# Altium schematic sheet SH1 - NUCLEO HEADERS.SchDoc: Nucleo Headers
size B; CheckedBy: Wolfgang Windholtz; Engineer: Sahil Kale; Revision: 1; SheetNumber: 1; SheetTotal: 6
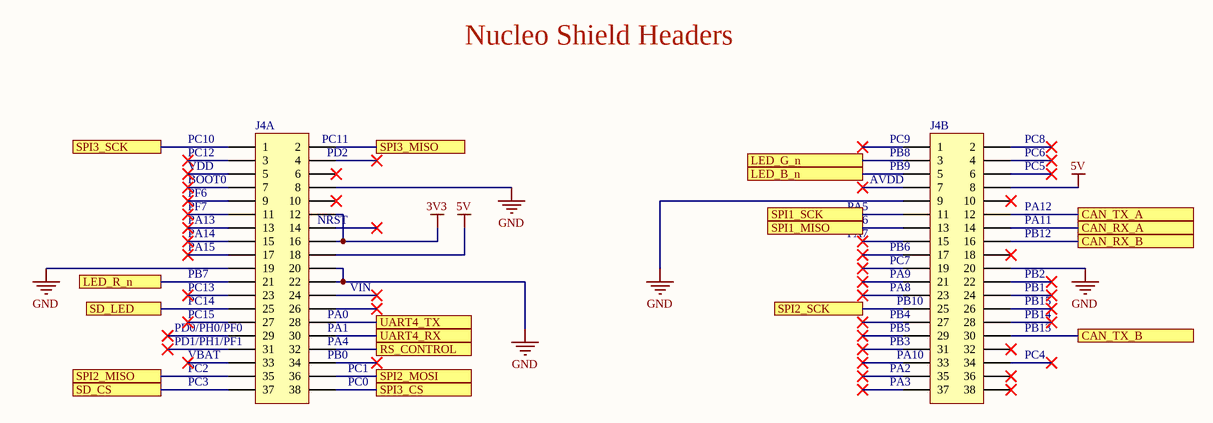
[diagram p0: SH1 - NUCLEO HEADERS.SchDoc]

## Parts
J4  HEADER_NUCLEO  [HEADER_NUCLEO]  (value not drawn)  (parts A,B of 2)

## Ports
CAN_RX_A, CAN_RX_B, CAN_TX_A, CAN_TX_B, LED_B_n, LED_G_n, LED_R_n, RS_CONTROL, SD_CS, SD_LED, SPI1_MISO, SPI1_SCK, SPI2_MISO, SPI2_MOSI, SPI2_SCK, SPI3_CS, SPI3_MISO, SPI3_SCK, UART4_RX, UART4_TX

## Nets
3V3: J4.12 J4.16
5V: J4.18 J4.46(8)
GND: J4.8 J4.19 J4.20 J4.22 J4.47(9) J4.58(20)
CAN_RX_A: J4.52(14) ; port CAN_RX_A
CAN_RX_B: J4.54(16) ; port CAN_RX_B
CAN_TX_A: J4.50(12) ; port CAN_TX_A
CAN_TX_B: J4.68(30) ; port CAN_TX_B
LED_B_n: J4.43(5) ; port LED_B_n
LED_G_n: J4.41(3) ; port LED_G_n
LED_R_n: J4.21 ; port LED_R_n
RS_CONTROL: J4.32 ; port RS_CONTROL
SD_CS: J4.37 ; port SD_CS
SD_LED: J4.25 ; port SD_LED
SPI1_MISO: J4.51(13) ; port SPI1_MISO
SPI1_SCK: J4.49(11) ; port SPI1_SCK
SPI2_MISO: J4.35 ; port SPI2_MISO
SPI2_MOSI: J4.36 ; port SPI2_MOSI
SPI2_SCK: J4.63(25) ; port SPI2_SCK
SPI3_CS: J4.38 ; port SPI3_CS
SPI3_MISO: J4.2 ; port SPI3_MISO
SPI3_SCK: J4.1 ; port SPI3_SCK
UART4_RX: J4.30 ; port UART4_RX
UART4_TX: J4.28 ; port UART4_TX

Not connected (* = marked no-connect by the designer): J4 3* 4* 5* 6* 7* 9* 10* 11* 13* 14* 15* 17* 23* 24* 26* 27* 29* 31* 33* 34* 39(1)* 40(2)* 42(4)* 44(6)* 45(7)* 48(10)* 53(15)* 55(17)* 56(18)* 57(19)* 59(21)* 60(22)* 61(23)* 62(24)* 64(26)* 65(27)* 66(28)* 67(29)* 69(31)* 70(32)* 71(33)* 72(34)* 73(35)* 74(36)* 75(37)* 76(38)*

## Notes on the sheet
- Nucleo Shield Headers
- (near J4) PC10
- (near J4) PC12
- (near J4) BOOT0
- (near J4) VDD
- (near J4) PC11
- (near J4) PD2
- (near J4) AVDD
- (near J4) PC9
- (near J4) PB8
- (near J4) PB9
- (near J4) PC8
- (near J4) PC6
- (near J4) PC5
- (near J4) PF7
- (near J4) PF6
- (near J4) PA13
- (near J4) PA14
- (near J4) NRST
- (near J4) PA5
- (near J4) PA6
- (near J4) PA7
- (near J4) PA12
- (near J4) PA11
- (near J4) PB12
- (near J4) PA15
- (near J4) PB7
- (near J4) PC13
- (near J4) PC14
- (near J4) PC15
- (near J4) PA0
- (near J4) VIN
- (near J4) PB6
- (near J4) PC7
- (near J4) PA9
- (near J4) PA8
- (near J4) PB4
- (near J4) PB10
- (near J4) PB1
- (near J4) PB2
- (near J4) PB15
- (near J4) PB14
- (near J4) PD0/PH0/PF0
- (near J4) PD1/PH1/PF1
- (near J4) PC2
- (near J4) VBAT
- (near J4) PA1
- (near J4) PA4
- (near J4) PB0
- (near J4) PC1
- (near J4) PB5
- (near J4) PB3
- (near J4) PA2
- (near J4) PA10
- (near J4) PC4
- (near J4) PB13
- (near J4) PC3
- (near J4) PC0
- (near J4) PA3
- Title:
- Project:
- Date:
- Rev:
- Checker:
- Engineer:
- Sheet:
- of

## Library data of the parts
J4 = HEADER_NUCLEO: CONN HDR 38POS 0.1 GOLD PCB; Manufacturer 1: Sullins; Manufacturer Part Number 1: PPPC192LFBN-RC; Package/Footprint: TH; Supplier 1: Digi-Key; Supplier Part Number 1: S7122-ND; Mounting Type: TH; Verified: No; LCSC Part #: *